# Altium schematic sheet MAZ000173 - Diagrama eléctrico.SchDoc: MAZ000173 - Diagrama eléctrico
size A; ApprovedBy: Christian Ledwidth; CheckedBy: Nahuel Martinez; Author: Santiago Marti; CompanyName: Body Health; DrawnBy: Santiago Marti; Revision: A; SheetNumber: 2; SheetTotal: 2
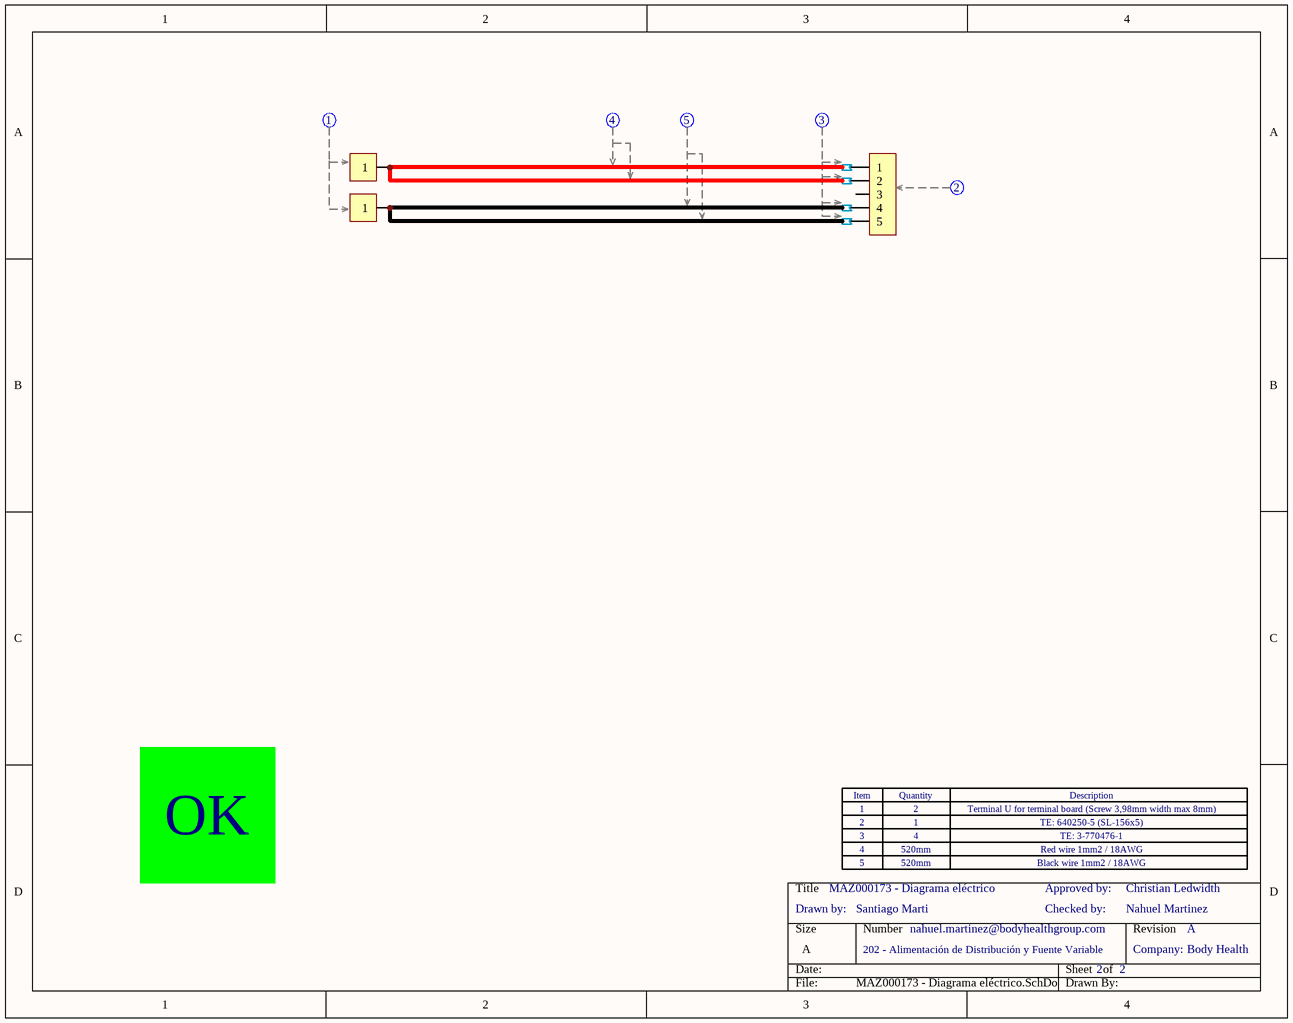
[diagram p0: MAZ000173 - Diagrama eléctrico.SchDoc]

## Parts
(Parts that share a designator on the sheet are numbered #1, #2 ... from top to bottom, then left to right.)
Con1  SL156-5  (value not drawn)  (part D of 4)
Con?#1  Spade  (value not drawn)  (part D of 4)
Con?#2  Spade  (value not drawn)  (part D of 4)
Soc1  sock_SL156_770476-1  (value not drawn)  (parts A,B of 2)
Soc2  sock_SL156_770476-1  (value not drawn)  (part B of 2)
Soc3  sock_SL156_770476-1  (value not drawn)  (parts A,B of 2)
Soc4  sock_SL156_770476-1  (value not drawn)  (parts A,B of 2)
Soc5  sock_SL156_770476-1  (value not drawn)  (part A of 2)
Soc6  sock_SL156_770476-1  (value not drawn)  (part A of 2)
Zoc1  Zócalo_Header  (value not drawn)
Zoc3  Zócalo_Item  (value not drawn)
Zoc4  Zócalo_Item  (value not drawn)
Zoc5  Zócalo_Item  (value not drawn)
Zoc6  Zócalo_Item  (value not drawn)
Zoc7  Zócalo_Item  (value not drawn)

## Nets
NetCon1_1: Con1.1 Soc1.0
NetCon1_2: Con1.2 Soc2.0
NetCon1_4: Con1.4 Soc3.0
NetCon1_5: Con1.5 Soc4.0
NetCon?#1_1: Con?#1.1 Soc1.1 Soc2.1
NetCon?#2_1: Con?#2.1 Soc3.1 Soc4.1

Not connected (* = marked no-connect by the designer): Con1 3

## Notes on the sheet
- OK
- 1
- 3
- 2
- 4
- Terminal U for terminal board (Screw 3,98mm width max 8mm)
- TE: 3-770476-1
- TE: 640250-5 (SL-156x5)
- Drawn by:
- 5
- 520mm
- Checked by:
- Approved by:
- Black wire 1mm2 / 18AWG
- Red wire 1mm2 / 18AWG
- 202 - Alimentación de Distribución y Fuente Variable
- nahuel.martinez@bodyhealthgroup.com
- Company:
- (in symbol Zócalo_Header) Item; Quantity; Description

## Library data of the parts
Con1 = SL156-5: CONN RECEPT 5 POS W/RAMP SL-156; Cod.Fabricante: 640250-5; Fabricante: TE Connectivity AMP Connectors; Cod.DigiKey: A19953-ND; ComponentLink1Description: Manufacturer Link; ComponentLink1URL: https://www.te.com/commerce/DocumentDelivery/DDEController?Action=srchrtrv&DocNm=640250&DocType=Customer+Drawing&DocLang=English; DIGIKEYx50: 0.19420; CallOut: *; DIGIKEYx100: 0.18660
Con?#1 Con?#2 = Spade: CONN HOUSING SPADE M4; Cod.DigiKey: -; Cod.Fabricante: -; ComponentLink1Description: Manufacturer Link; ComponentLink1URL: -; DIGIKEYx50: -; Fabricante: -; CallOut: *; DIGIKEYx100: -
Soc1 = sock_SL156_770476-1: CONN SOCKET 18-24AWG CRIMP TIN; Fabricante: TE Connectivity AMP Connectors; CallOut: 1; Cod.DigiKey: A19993CT-ND; Cod.Fabricante: 770476-1; ComponentLink1Description: Manufacturer Link; ComponentLink1URL: https://www.te.com/commerce/DocumentDelivery/DDEController?Action=srchrtrv&DocNm=770476&DocType=Customer+Drawing&DocLang=English; DIGIKEYx100: 0.08690; DIGIKEYx50: 0.08180
Soc2 = sock_SL156_770476-1: CONN SOCKET 18-24AWG CRIMP TIN; Fabricante: TE Connectivity AMP Connectors; Cod.DigiKey: A19993CT-ND; Cod.Fabricante: 770476-1; ComponentLink1Description: Manufacturer Link; ComponentLink1URL: https://www.te.com/commerce/DocumentDelivery/DDEController?Action=srchrtrv&DocNm=770476&DocType=Customer+Drawing&DocLang=English; DIGIKEYx100: 0.08690; CallOut: *; DIGIKEYx50: 0.08180
Soc3 = sock_SL156_770476-1: CONN SOCKET 18-24AWG CRIMP TIN; Fabricante: TE Connectivity AMP Connectors; CallOut: 5; Cod.DigiKey: A19993CT-ND; Cod.Fabricante: 770476-1; ComponentLink1Description: Manufacturer Link; ComponentLink1URL: https://www.te.com/commerce/DocumentDelivery/DDEController?Action=srchrtrv&DocNm=770476&DocType=Customer+Drawing&DocLang=English; DIGIKEYx100: 0.08690; DIGIKEYx50: 0.08180
Soc4 = sock_SL156_770476-1: CONN SOCKET 18-24AWG CRIMP TIN; Fabricante: TE Connectivity AMP Connectors; CallOut: 4; Cod.DigiKey: A19993CT-ND; Cod.Fabricante: 770476-1; ComponentLink1Description: Manufacturer Link; ComponentLink1URL: https://www.te.com/commerce/DocumentDelivery/DDEController?Action=srchrtrv&DocNm=770476&DocType=Customer+Drawing&DocLang=English; DIGIKEYx100: 0.08690; DIGIKEYx50: 0.08180
Soc5 = sock_SL156_770476-1: CONN SOCKET 18-24AWG CRIMP TIN; Fabricante: TE Connectivity AMP Connectors; CallOut: 3; Cod.DigiKey: A19993CT-ND; Cod.Fabricante: 770476-1; ComponentLink1Description: Manufacturer Link; ComponentLink1URL: https://www.te.com/commerce/DocumentDelivery/DDEController?Action=srchrtrv&DocNm=770476&DocType=Customer+Drawing&DocLang=English; DIGIKEYx100: 0.08690; DIGIKEYx50: 0.08180
Soc6 = sock_SL156_770476-1: CONN SOCKET 18-24AWG CRIMP TIN; Fabricante: TE Connectivity AMP Connectors; CallOut: 2; Cod.DigiKey: A19993CT-ND; Cod.Fabricante: 770476-1; ComponentLink1Description: Manufacturer Link; ComponentLink1URL: https://www.te.com/commerce/DocumentDelivery/DDEController?Action=srchrtrv&DocNm=770476&DocType=Customer+Drawing&DocLang=English; DIGIKEYx100: 0.08690; DIGIKEYx50: 0.08180
Zoc1 = Zócalo_Header: Header para el zócalo de referencias
Zoc3-Zoc7 = Zócalo_Item: Ítem para el zócalo de referencias; Desginator: *; Quantity: *; ItemDescription: *